# EAGLE design edcs (EAGLE 5.09)
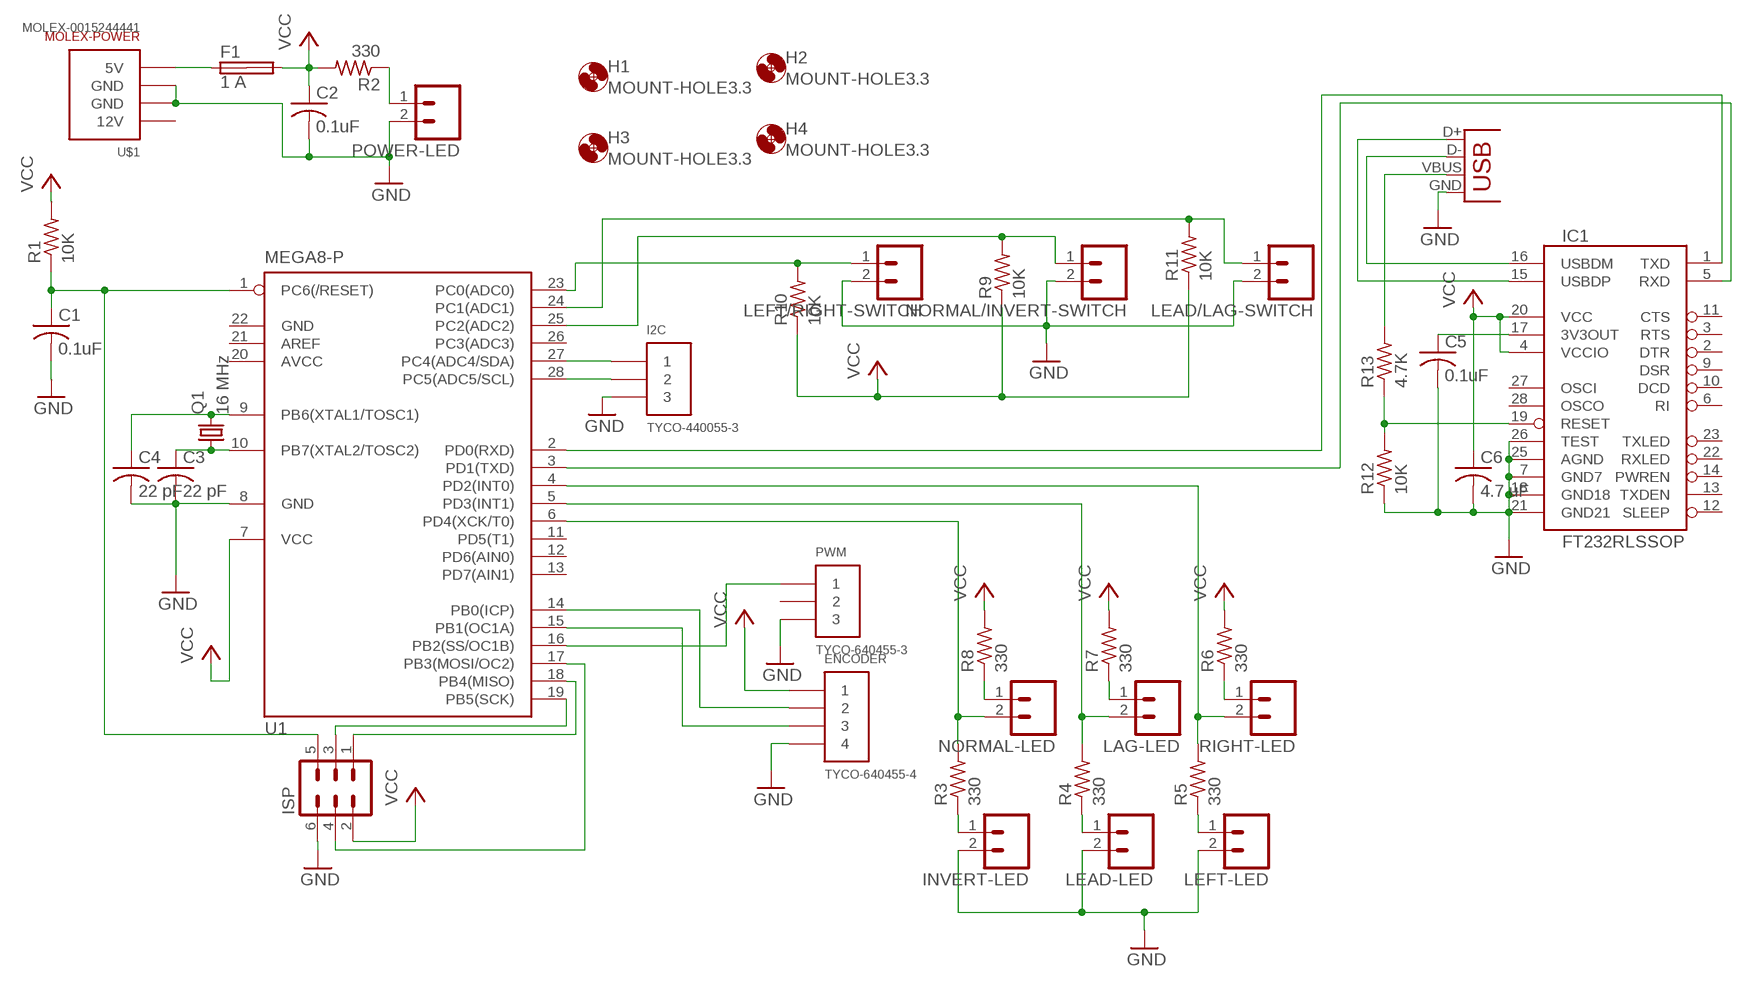
[diagram p0: schematic, sheet 1]

## Parts
C1  0.1uF  C-US050-055X075  [C050-055X075]
C2  0.1uF  C-US050-055X075  [C050-055X075]
C3  22 pF  C-USC1206  [C1206]
C4  22 pF  C-USC1206  [C1206]
C5  0.1uF  C-USC1206  [C1206]
C6  4.7 uF  C-USC1206  [C1206]
ENCODER  TYCO-640455-4  [HEADER-RA-POL-.100IN-4]
F1  1 A  SHK20Q  [SHK20Q]
H1  MOUNT-HOLE3.3  [3,3]
H2  MOUNT-HOLE3.3  [3,3]
H3  MOUNT-HOLE3.3  [3,3]
H4  MOUNT-HOLE3.3  [3,3]
I2C  TYCO-440055-3  [HEADER-RA-2.00MM-3]
IC1  FT232RLSSOP  [SSOP28DB]
INVERT-LED  M02POLAR  [MOLEX-1X2]
ISP  MA03-2  [MA03-2]
LAG-LED  M02POLAR  [MOLEX-1X2]
LEAD-LED  M02POLAR  [MOLEX-1X2]
LEAD/LAG-SWITCH  M02POLAR  [MOLEX-1X2]
LEFT-LED  M02POLAR  [MOLEX-1X2]
LEFT/RIGHT-SWITCH  M02POLAR  [MOLEX-1X2]
NORMAL-LED  M02POLAR  [MOLEX-1X2]
NORMAL/INVERT-SWITCH  M02POLAR  [MOLEX-1X2]
POWER-LED  M02POLAR  [MOLEX-1X2]
PWM  TYCO-640455-3  [HEADER-RA-POL-.100IN-3]
Q1  16 MHz  CRYSTALHC49S  [HC49/S]
R1  10K  R-US_R1206  [R1206]
R2  330  R-US_R1206  [R1206]
R3  330  R-US_R1206  [R1206]
R4  330  R-US_R1206  [R1206]
R5  330  R-US_R1206  [R1206]
R6  330  R-US_R1206  [R1206]
R7  330  R-US_R1206  [R1206]
R8  330  R-US_R1206  [R1206]
R9  10K  R-US_R1206  [R1206]
R10  10K  R-US_R1206  [R1206]
R11  10K  R-US_R1206  [R1206]
R12  10K  R-US_R1206  [R1206]
R13  4.7K  R-US_R1206  [R1206]
RIGHT-LED  M02POLAR  [MOLEX-1X2]
U1  MEGA8-P  [DIL28-3]
U$1  MOLEX-0015244441  [MOLEX-0015244441B]
X1  USBPTH  [USB-B-PTH]

## Nets
GND: C1.2 C2.2 C3.2 C4.2 C5.2 C6.2 ENCODER.4 I2C.3 IC1.7(GND7) IC1.18(GND18) IC1.21(GND21) IC1.25(AGND) IC1.26(TEST) INVERT-LED.2 ISP.6 LEAD-LED.2 LEAD/LAG-SWITCH.2 LEFT-LED.2 LEFT/RIGHT-SWITCH.2 NORMAL/INVERT-SWITCH.2 POWER-LED.2 PWM.3 R12.1 U1.8(GND) U$1.2(GND) U$1.3(GND) X1.GND
N$1: C3.1 Q1.1 U1.10(PB7(XTAL2/TOSC2))
N$2: C4.1 Q1.2 U1.9(PB6(XTAL1/TOSC1))
N$3: C1.1 ISP.5 R1.1 U1.1(PC6(/RESET))
N$4: F1.1A U$1.4(5V)
N$5: ENCODER.2 U1.14(PB0(ICP))
N$6: ENCODER.3 U1.15(PB1(OC1A))
N$7: PWM.1 U1.16(PB2(SS/OC1B))
N$8: I2C.1 U1.27(PC4(ADC4/SDA))
N$9: I2C.2 U1.28(PC5(ADC5/SCL))
N$10: NORMAL/INVERT-SWITCH.1 R9.2 U1.25(PC2(ADC2))
N$11: LEAD/LAG-SWITCH.1 R11.2 U1.24(PC1(ADC1))
N$12: R5.2 RIGHT-LED.2 U1.4(PD2(INT0))
N$13: LEFT/RIGHT-SWITCH.1 R10.2 U1.23(PC0(ADC0))
N$14: ISP.1 U1.18(PB4(MISO))
N$15: IC1.5(RXD) U1.3(PD1(TXD))
N$16: LAG-LED.2 R4.2 U1.5(PD3(INT1))
N$17: NORMAL-LED.2 R3.2 U1.6(PD4(XCK/T0))
N$18: NORMAL-LED.1 R8.1
N$19: INVERT-LED.1 R3.1
N$20: LAG-LED.1 R7.1
N$21: LEAD-LED.1 R4.1
N$22: R6.1 RIGHT-LED.1
N$23: LEFT-LED.1 R5.1
N$24: IC1.15(USBDP) X1.D+
N$25: C5.1 IC1.17(3V3OUT)
N$26: IC1.16(USBDM) X1.D-
N$27: IC1.19(RESET) R12.2 R13.1
N$28: POWER-LED.1 R2.1
N$29: IC1.1(TXD) U1.2(PD0(RXD))
N$30: R13.2 X1.VBUS
N$31: ISP.3 U1.19(PB5(SCK))
N$33: ISP.4 U1.17(PB3(MOSI/OC2))
VCC: C2.1 C6.1 ENCODER.1 F1.2A IC1.4(VCCIO) IC1.20(VCC) ISP.2 R1.2 R2.2 R6.2 R7.2 R8.2 R9.1 R10.1 R11.1 U1.7(VCC)
Unconnected: F1.1B F1.2B IC1.2(DTR) IC1.3(RTS) IC1.6(RI) IC1.9(DSR) IC1.10(DCD) IC1.11(CTS) IC1.12(SLEEP) IC1.13(TXDEN) IC1.14(PWREN) IC1.22(RXLED) IC1.23(TXLED) IC1.27(OSCI) IC1.28(OSCO) PWM.2 U1.11(PD5(T1)) U1.12(PD6(AIN0)) U1.13(PD7(AIN1)) U1.21(AREF) U1.26(PC3(ADC3))

## Power pins joined to a net without a drawn wire
12V: U$1.1(12V)
AVCC: U1.20(AVCC)
GND: U1.22(GND)

## Library data of the parts
C1 C2 = resistor:C-US: CAPACITOR, American symbol
C3-C6 = rcl:C-US: CAPACITOR, American symbol
ENCODER = chicagoedt:TYCO-640455-4: 4 pin right angle header with polarizing tab and .100" pitch.
F1 = fuse:SHK20Q: FUSE HOLDER 5 x 20 mm, SH contact, E1207 Buerklin 64G6061
H1-H4 = holes:MOUNT-HOLE: MOUNTING HOLE with drill center marker
I2C = chicagoedt:TYCO-440055-3: 3 pin right angle header with shroud and 2.00 mm pitch.
IC1 = SparkFun:FT232RL: USB UART FT232RL 4th Generation USB UART (USB <-> Serial) Controller. Spark Fun Electronics SKU : COM-00650
INVERT-LED LAG-LED LEAD-LED LEAD/LAG-SWITCH LEFT-LED LEFT/RIGHT-SWITCH NORMAL-LED NORMAL/INVERT-SWITCH POWER-LED RIGHT-LED = SparkFun:M02: Header 2 Standard 2-pin 0.1" header. Use with straight break away headers (SKU : PRT-00116), right angle break away headers (PRT-00553), swiss pins (PRT-00743), machine pins (PRT-00117), and female headers (PRT-00115). Molex polarized connector foot print use with SKU : PRT-08233 with associated crimp pins and housings.
ISP = con-lstb:MA03-2: PIN HEADER
PWM = chicagoedt:TYCO-640455-3: 3 pin right angle header with polarizing tab and .100" pitch.
Q1 = crystal:CRYSTAL: CRYSTAL
R1-R13 = rcl:R-US_: RESISTOR, American symbol
U1 = atmel:MEGA8-P: MICROCONTROLLER 8 Kbytes FLASH, 1 kbytes SRAM, 512 bytes EEPROM, USART, 4-channel 10 bit ADC, 2-channel 8 bit ADC Pin compatible with Atmega48, ATMega88, ATMega168 Source: avr.lbr
U$1 = chicagoedt:MOLEX-0015244441: 5.08mm (.200") Pitch Disk Drive Power Connection System Header, Right Angle, Through Hole, 4 Circuits, Lead-free, 3.56mm (.140") PC Tail Length, with PCB Locator Peg
X1 = SparkFun:USB: USB Connectors USB-B-PTH is fully proven SKU : PRT-00139 USB-miniB is fully proven SKU : PRT-00587 USB-A-PCB is untested. USB-A-H is throughly reviewed, but untested. Spark Fun Electronics SKU : PRT-00437 USB-B-SMT is throughly reviewed, but untested. Needs silkscreen touching up. USB-A-S has not been used/tested USB-MB-H has not been used/tested

## Board
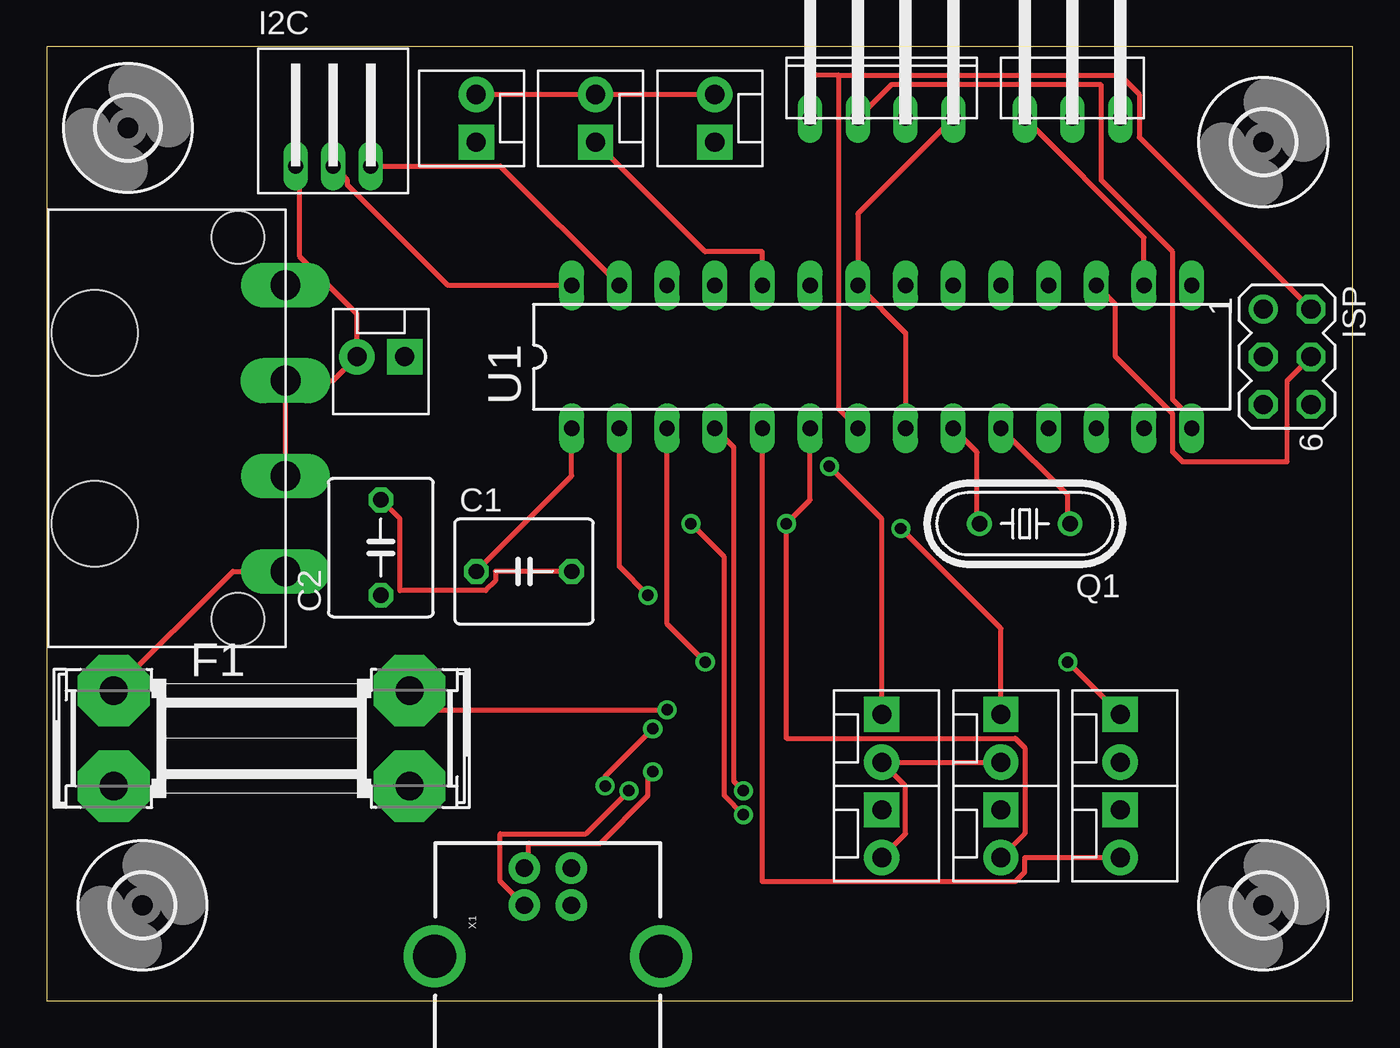
[diagram p1: board, top side]
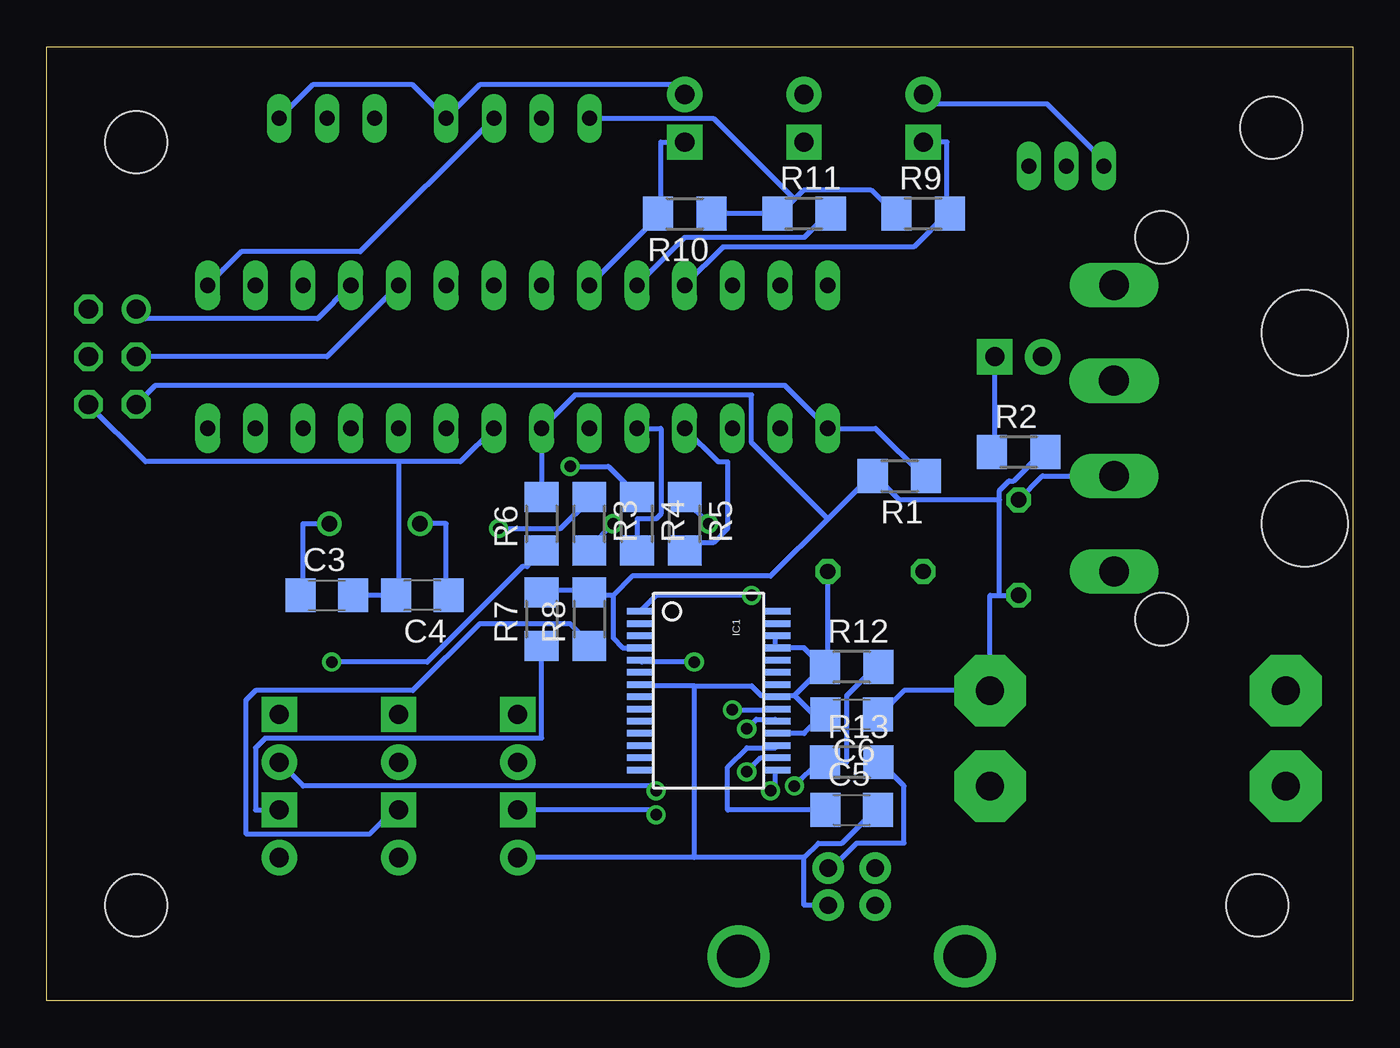
[diagram p2: board, bottom side, seen from below]

Size 69.52 x 50.79 mm. Coordinates in mm from the lower left corner, seen from the top.
Outline: 0,0 69.52,0 69.52,50.79 0,50.79 0,0
Copper layers (1*16): Top 0.035mm / dielectric 1.5mm / Bottom 0.035mm
Design rules "default": minimum track width 10mil, minimum drill 24mil, track to track 8mil, track to pad 8mil, pad to pad 8mil, via to via 8mil, smd to smd 8mil, copper to edge 40mil, drill to drill 8mil, minimum pad ring 10mil, minimum via ring 8mil, stop-mask expansion 4mil, vias tented up to drill 0mil, thermal gap 10mil

### Footprints (pad centres in the part's own frame; a part is rotated, then mirrored left to right if it is on the bottom)
C050-055X075 = drill 0.813 octagon: 1 -2.54,0; 2 2.54,0
C1206 = smd 1.6 x 1.8: 1 -1.4,0; 2 1.4,0
HEADER-RA-POL-.100IN-4 = drill 0.8 long: 1 -3.81,-5.08; 2 -1.27,-5.08; 3 1.27,-5.08; 4 3.81,-5.08
SHK20Q = drill 1.5 pad 3.81 octagon: 1A -7.874,2.54; 1B -7.874,-2.54; 2A 7.874,2.54; 2B 7.874,-2.54
3,3 = hole 3.3: 0,0
HEADER-RA-2.00MM-3 = drill 0.8 long: 1 2,0; 2 0,0; 3 -2,0
SSOP28DB = smd 0.348 x 1.397: 1 -4.225,-3.656; 2 -3.575,-3.656; 3 -2.925,-3.656; 4 -2.275,-3.656; 5 -1.625,-3.656; 6 -0.975,-3.656; 7 -0.325,-3.656; 8 0.325,-3.656; 9 0.975,-3.656; 10 1.625,-3.656; 11 2.275,-3.656; 12 2.925,-3.656; 13 3.575,-3.656; 14 4.225,-3.656; 15 4.225,3.656; 16 3.575,3.656; 17 2.925,3.656; 18 2.275,3.656; 19 1.625,3.656; 20 0.975,3.656; 21 0.325,3.656; 22 -0.325,3.656; 23 -0.975,3.656; 24 -1.625,3.656; 25 -2.275,3.656; 26 -2.925,3.656; 27 -3.575,3.656; 28 -4.225,3.656
MOLEX-1X2 = drill 1.016 pad 1.88 square: 1 0,0 | drill 1.016 pad 1.88 round: 2 2.54,0
MA03-2 = drill 1.016 round: 1 -2.54,-1.27 | drill 1.016 octagon: 2 -2.54,1.27; 3 0,-1.27; 4 0,1.27; 5 2.54,-1.27; 6 2.54,1.27
HEADER-RA-POL-.100IN-3 = drill 0.8 long: 1 -2.54,-5.08; 2 0,-5.08; 3 2.54,-5.08
HC49/S = drill 0.813 round: 1 -2.413,0; 2 2.413,0
R1206 = smd 1.6 x 1.803: 1 -1.422,0; 2 1.422,0
DIL28-3 = drill 0.813 long: 1 -16.51,-3.81; 2 -13.97,-3.81; 3 -11.43,-3.81; 4 -8.89,-3.81; 5 -6.35,-3.81; 6 -3.81,-3.81; 7 -1.27,-3.81; 8 1.27,-3.81; 9 3.81,-3.81; 10 6.35,-3.81; 11 8.89,-3.81; 12 11.43,-3.81; 13 13.97,-3.81; 14 16.51,-3.81; 15 16.51,3.81; 16 13.97,3.81; 17 11.43,3.81; 18 8.89,3.81; 19 6.35,3.81; 20 3.81,3.81; 21 1.27,3.81; 22 -1.27,3.81; 23 -3.81,3.81; 24 -6.35,3.81; 25 -8.89,3.81; 26 -11.43,3.81; 27 -13.97,3.81; 28 -16.51,3.81
MOLEX-0015244441B = drill 1.587 pad 1.778 long: 1 7.62,-6.35; 3 -2.54,-6.35; 4 -7.62,-6.35 | drill 1.6 pad 1.651 long: 2 2.54,-6.35 | hole 2.794: -10.16,-3.81; 10.16,-3.81 | hole 4.572: -5.08,3.81; 5.08,3.81
USB-B-PTH = drill 0.914 pad 1.676 round: D+ 0,1.25; D- 1.981,1.25; GND 0,-1.25; VBUS 1.981,-1.25 | drill 2.286 round: P$1 -2.718,-6.02; P$2 -2.718,6.02

### Placement (x,y rotation side)
C1  25.4,22.86 0 top
C2  17.78,24.13 90 top
C3  54.61,21.59 0 bottom
C4  49.53,21.59 180 bottom
C5  26.67,10.16 0 bottom
C6  26.67,15.24 180 bottom
ENCODER  44.45,52.07 0 top
F1  11.43,13.97 0 top
H1  5.08,5.08 0 top
H2  4.32,46.48 0 top
H3  64.77,45.72 0 top
H4  64.77,5.08 0 top
I2C  15.24,44.45 0 top
IC1  34.29,16.51 270 bottom
INVERT-LED  50.8,15.24 270 top
ISP  66.04,34.29 270 top
LAG-LED  57.15,10.16 270 top
LEAD-LED  44.45,15.24 270 top
LEAD/LAG-SWITCH  29.21,45.72 90 top
LEFT-LED  44.45,10.16 270 top
LEFT/RIGHT-SWITCH  35.56,45.72 90 top
NORMAL-LED  50.8,10.16 270 top
NORMAL/INVERT-SWITCH  22.86,45.72 90 top
POWER-LED  19.05,34.29 180 top
PWM  54.61,52.07 0 top
Q1  52.07,25.4 180 top
R1  24.13,27.94 180 bottom
R2  17.78,29.21 0 bottom
R3  40.64,25.4 270 bottom
R4  38.1,25.4 270 bottom
R5  35.56,25.4 270 bottom
R6  43.18,25.4 90 bottom
R7  43.18,20.32 90 bottom
R8  40.64,20.32 90 bottom
R9  22.86,41.91 0 bottom
R10  35.56,41.91 180 bottom
R11  29.21,41.91 0 bottom
R12  26.67,17.78 0 bottom
R13  26.67,12.7 0 bottom
RIGHT-LED  57.15,15.24 270 top
U1  44.45,34.29 0 top
U$1  6.35,30.48 90 top
X1  26.67,5.08 90 top

### Tracks (layer width: path | path; a pad name or v marks a point on that pad's centre or on a via)
GND
  Top 0.254: ENCODER.4 43.18,41.91 U1.22 45.72,35.56 U1.8 | LEFT-LED.2 45.72,8.89 45.72,11.43 LEAD-LED.2 INVERT-LED.2 | NORMAL/INVERT-SWITCH.2 LEAD/LAG-SWITCH.2 LEFT/RIGHT-SWITCH.2 | C1.2 23.88,22.86 23.88,22.35 23.37,21.84 18.8,21.84 18.8,25.65 C2.2 | I2C.3 13.46,44.45 13.46,39.62 16.51,36.58 POWER-LED.2 15.24,33.02 U$1.2 U$1.3
  Bottom 0.254: PWM.3 55.37,48.77 50.04,48.77 ENCODER.4 46.48,48.77 36.07,48.77 LEFT/RIGHT-SWITCH.2 | C3.2 C4.2 50.8,21.59 50.8,28.7 | 50.8,28.7 47.5,28.7 U1.8 | ISP.6 64.26,28.7 50.8,28.7 | IC1.26 30.73,19.3 30.73,18.8 IC1.25 30.48,18.8 29.21,18.8 28.19,17.78 | C1.2 27.94,17.78 R12.1 28.19,17.78 | 28.45,14.99 28.19,15.24 C6.2 28.45,14.99 | 28.45,14.99 29.21,14.22 30.48,14.22 IC1.18 | 29.72,16.26 30.48,16.26 IC1.21 30.73,16.26 31.5,16.26 32,16.76 35.05,16.76 | 29.72,16.26 28.45,14.99 | 35.05,16.76 37.85,16.76 IC1.7 | 29.72,16.26 28.19,17.78 | 29.21,7.62 28.45,8.38 27.18,8.38 25.4,10.16 C5.2 | 29.21,7.62 29.21,5.08 X1.GND | 35.05,7.62 LEFT-LED.2 | 29.21,7.62 35.05,7.62 | 35.05,7.62 35.05,16.76 | C2.2 16.51,27.94 U$1.3 | I2C.3 13.46,44.45 13.46,44.96 16.26,47.75 22.35,47.75 NORMAL/INVERT-SWITCH.2
N$1
  Top 0.254: U1.10 54.36,26.92 54.36,25.4 Q1.1
  Bottom 0.254: C3.1 55.88,21.59 55.88,25.4 Q1.1
N$2
  Top 0.254: U1.9 49.53,29.21 49.53,25.4 Q1.2
  Bottom 0.254: C4.1 48.26,21.59 48.26,25.4 Q1.2
N$3
  Top 0.254: C1.1 27.94,27.94 U1.1
  Bottom 0.254: R1.1 22.86,27.94 25.4,30.48 U1.1 30.23,32.77 63.75,32.77 ISP.5
N$4
  Top 0.254: U$1.4 9.91,22.86 F1.1A
N$5
  Top 0.254: ENCODER.2 44.96,48.77 56.13,48.77 56.13,43.69 59.94,39.88 59.94,32 60.96,30.99 U1.14
N$6
  Bottom 0.254: ENCODER.3 52.83,39.88 59.18,39.88 U1.15
N$7
  Top 0.254: PWM.1 58.42,40.64 U1.16
N$8
  Top 0.254: U1.27 24.13,44.45 I2C.1
N$9
  Top 0.254: I2C.2 16,43.69 16,43.43 21.34,38.1 U1.28
N$10
  Bottom 0.254: 21.59,41.91 21.59,45.72 NORMAL/INVERT-SWITCH.1 | U1.25 33.53,40.13 23.37,40.13 21.59,41.91 | R9.2 21.59,41.91
N$11
  Top 0.254: LEAD/LAG-SWITCH.1 35.05,39.88 38.1,39.88 U1.24
  Bottom 0.254: U1.24 35.56,40.64 29.21,40.64 27.94,41.91 R11.2
N$12  (via drill 0.61)
  Top 0.254: v37.08,11.18 36.58,11.68 36.58,29.46 U1.4
  Bottom 0.254: U1.4 33.78,28.7 33.27,28.7 33.27,25.15 34.04,24.38 35.31,24.38 35.56,24.13 R5.2 | RIGHT-LED.2 55.88,11.43 37.34,11.43 v37.08,11.18
N$13
  Bottom 0.254: 36.83,41.91 36.83,45.72 LEFT/RIGHT-SWITCH.1 | 36.83,41.91 U1.23 | R10.2 36.83,41.91
N$14
  Bottom 0.254: U1.18 55.12,36.32 64.26,36.32 ISP.1
N$15  (via drill 0.61)
  Top 0.254: v35.05,18.03 33.02,20.07 U1.3
  Bottom 0.254: v35.05,18.03 37.85,18.03 IC1.5
N$16
  Top 0.254: LAG-LED.2 52.07,7.62 52.07,6.86 51.56,6.35 38.1,6.35 U1.5
  Bottom 0.254: U1.5 36.83,30.48 36.83,25.91 37.08,25.65 38.1,25.65 R4.2
N$17  (via drill 0.61)
  Top 0.254: U1.6 40.64,26.67 v39.37,25.4 39.37,13.97 51.56,13.97 52.07,13.46 52.07,8.89 NORMAL-LED.2
  Bottom 0.254: v39.37,25.4 40.64,24.13 R3.2
N$18
  Bottom 0.254: NORMAL-LED.1 51.05,10.16 52.32,8.89 58.93,8.89 58.93,16 58.42,16.51 50.04,16.51 46.48,20.07 41.66,20.07 40.64,19.05 R8.1
N$19  (via drill 0.61)
  Top 0.254: v45.47,25.15 50.8,19.81 INVERT-LED.1
  Bottom 0.254: v45.47,25.15 42.16,25.15 40.64,26.67 R3.1
N$20
  Bottom 0.254: LAG-LED.1 58.42,10.16 58.42,13.46 57.91,13.97 43.18,13.97 R7.1
N$21  (via drill 0.61)
  Top 0.254: v41.66,28.45 44.45,25.65 LEAD-LED.1
  Bottom 0.254: v41.66,28.45 39.62,28.45 38.1,26.92 R4.1
N$22  (via drill 0.61)
  Top 0.254: v54.36,18.03 RIGHT-LED.1
  Bottom 0.254: v54.36,18.03 49.28,18.03 44.2,23.11 43.94,23.11 43.18,23.88 R6.1
N$23  (via drill 0.61)
  Top 0.254: v34.29,25.4 36.07,23.62 36.07,10.92 v37.08,9.91
  Bottom 0.254: v34.29,25.4 35.56,26.67 R5.1 | v37.08,9.91 37.34,10.16 LEFT-LED.1
N$24  (via drill 0.61)
  Top 0.254: v30.99,11.18 28.7,8.89 24.13,8.89 24.13,6.35 25.4,5.08 X1.D+
  Bottom 0.254: v30.99,11.18 30.73,11.18 30.73,12.19 IC1.15
N$25
  Bottom 0.254: IC1.17 30.73,13.46 32.26,13.46 33.27,12.45 33.27,10.16 C5.1
N$26  (via drill 0.61)
  Top 0.254: v32.26,12.19 32,11.94 32,10.92 29.46,8.38 25.65,8.38 25.65,7.11 X1.D-
  Bottom 0.254: v32.26,12.19 31.5,12.95 30.73,12.95 IC1.16
N$27  (via drill 0.61)
  Top 0.254: v32.26,14.48 29.72,11.94 v29.72,11.43
  Bottom 0.254: v32.26,14.48 31.75,14.99 30.73,14.99 IC1.19 | v29.72,11.43 28.45,12.7 R13.1 26.92,12.7 26.92,16.26 25.4,17.78 R12.2
N$28
  Bottom 0.254: POWER-LED.1 19.05,29.21 R2.1
N$29  (via drill 0.61)
  Top 0.254: v32,21.59 30.48,23.11 U1.2
  Bottom 0.254: v32,21.59 37.08,21.59 37.85,20.83 IC1.1
N$30
  Bottom 0.254: R13.2 25.15,12.7 23.88,11.43 23.88,8.38 26.42,8.38 27.69,7.11 X1.VBUS
N$31
  Bottom 0.254: U1.19 54.61,34.29 ISP.3
N$33
  Top 0.254: U1.17 56.9,37.08 56.9,34.29 59.94,31.24 59.94,29.21 60.45,28.7 66.04,28.7 66.04,33.02 ISP.4
VCC  (via drill 0.61)
  Top 0.254: v33.02,15.49 19.3,15.49 F1.2A | ISP.2 58.17,45.97 58.17,48.26 57.15,49.28 42.16,49.28 | 42.16,49.28 40.64,49.28 ENCODER.1 | U1.7 42.16,31.5 42.16,49.28
  Bottom 0.254: v33.02,15.49 30.73,15.49 IC1.20 | C6.1 25.15,15.24 23.88,16.51 F1.2A 19.3,21.59 18.8,21.59 | 39.37,21.59 39.37,19.3 38.86,18.8 38.1,18.8 IC1.4 | 39.37,21.59 40.64,21.59 R8.2 40.64,21.84 43.18,21.84 R7.2 | 18.8,21.59 18.8,26.67 | 18.8,26.67 18.8,27.18 18.29,27.69 18.03,27.69 16.51,29.21 R2.2 | 18.8,21.59 C2.1 | 18.8,26.67 24.13,26.67 25.4,27.94 R1.2 25.65,27.94 27.94,25.65 | 39.37,21.59 38.35,22.61 30.99,22.61 27.94,25.65 | R6.2 U1.7 41.4,32.26 32,32.26 32,29.72 27.94,25.65 | 29.72,42.67 30.48,41.91 R11.1 R10.1 | 29.72,42.67 29.21,43.18 25.65,43.18 24.38,41.91 R9.1 | ENCODER.1 34.04,46.99 29.72,42.67